# EAGLE design badge (EAGLE 9.5.1)
This is an electronic name badge for DigiGirls
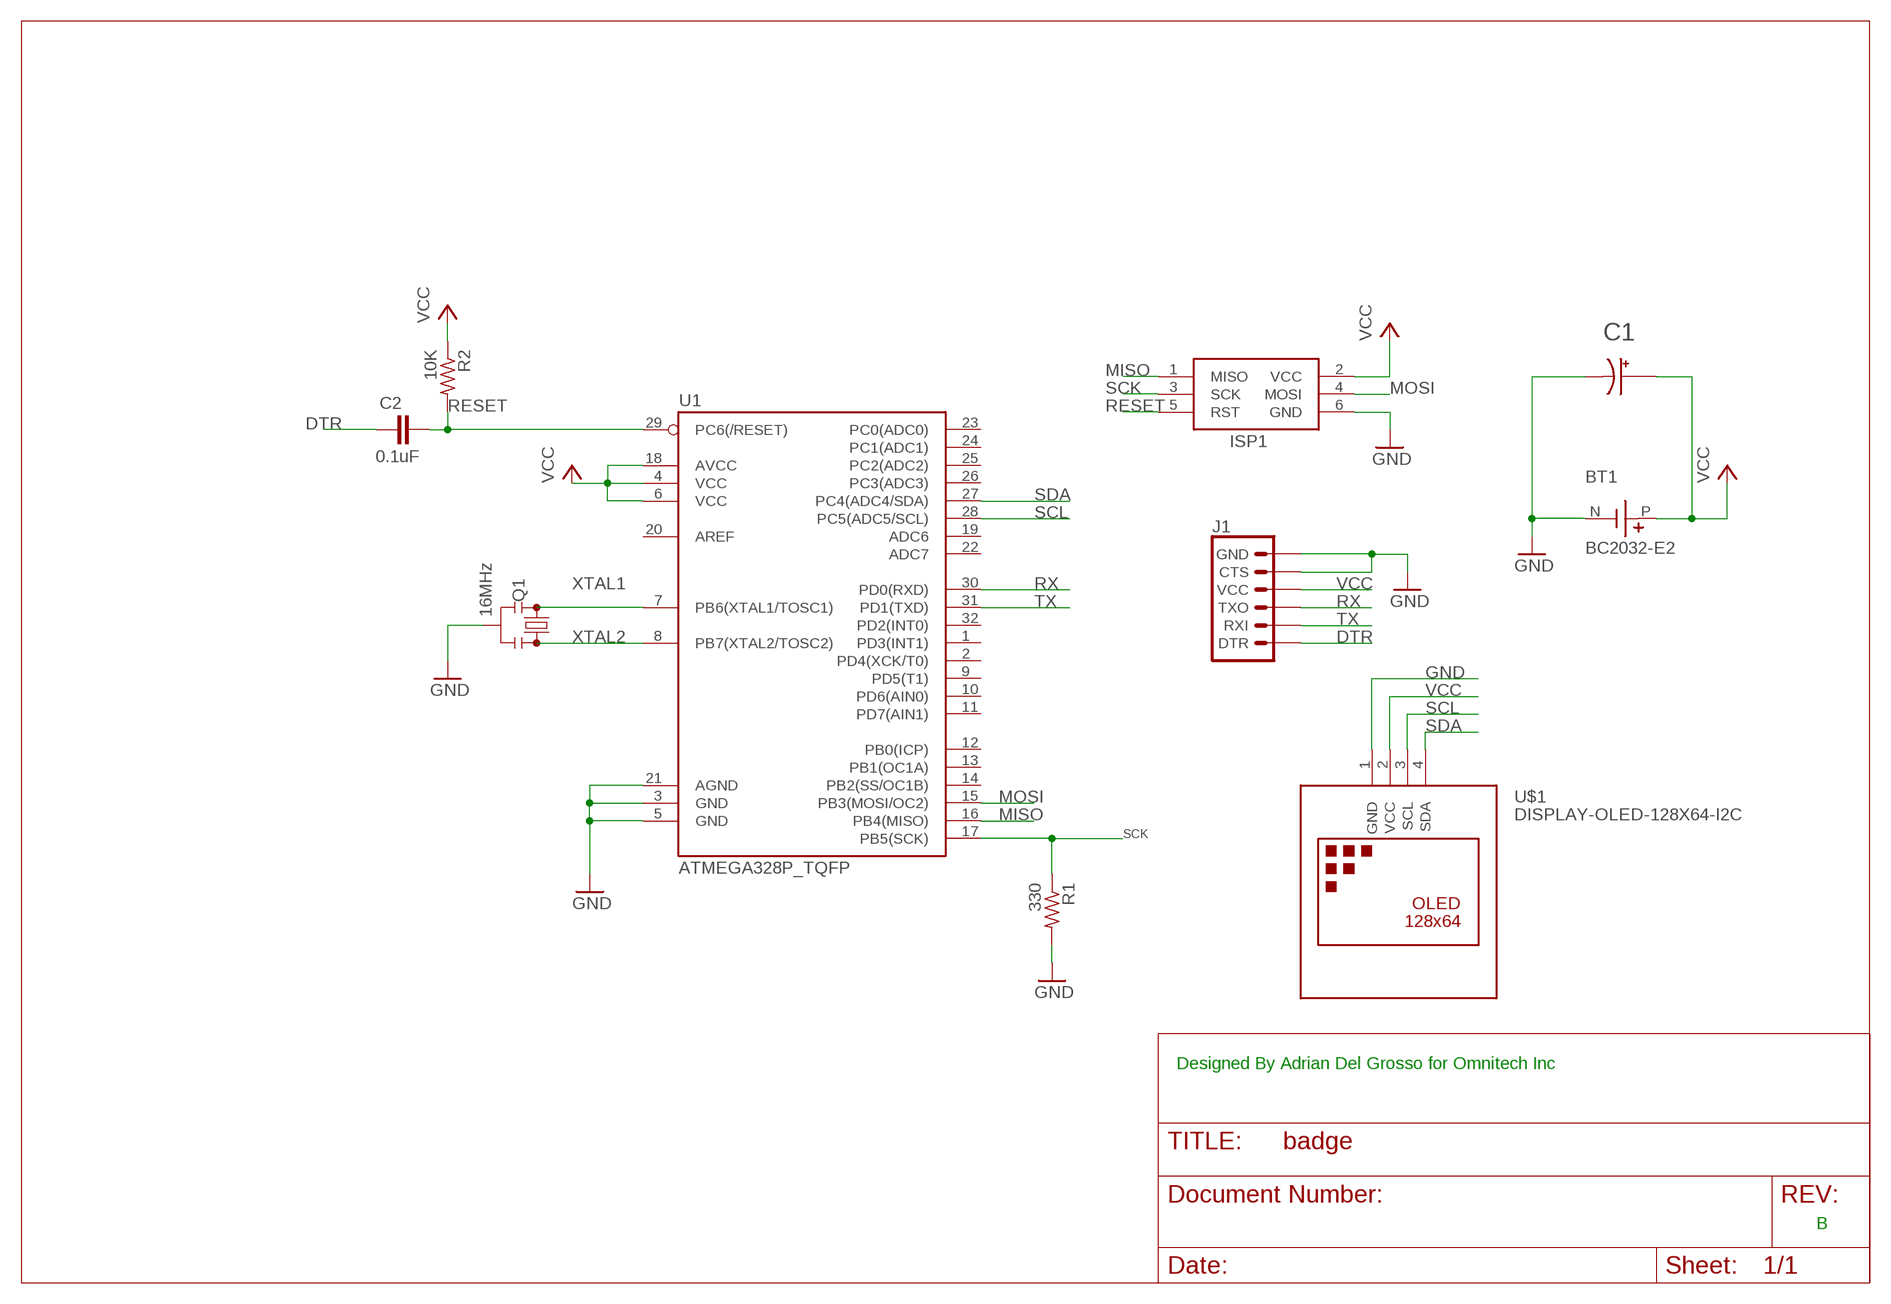
[diagram p0: schematic, sheet 1]

## Parts
BT1  BC2032-E2  [MPD_BC2032-E2]
C1  RNE1C101MDS1PX  [CAPPRD200W50D500H1000]
C2  0.1uF  0.1UF-0402-16V-10%  [0402]
ISP1  AVRISP-6  [AVRISP]
J1  6_PIN_SERIAL_TARGETLONGPADS  [1X06_LONGPADS]
Q1  16MHz  RESONATOR-8MHZSMD_3.2X1.3  [RESONATOR-SMD-3.2X1.3]
R1  330  R-US_R0603  [R0603]
R2  10K  R-US_R0603  [R0603]
U1  ATMEGA328P_TQFP  [TQFP32-08]
U$1  DISPLAY-OLED-128X64-I2C  [DISPLAY-OLED-128X64-I2C]

## Nets
DTR: C2.1 J1.1(DTR)
GND: BT1.N C1.2(N) ISP1.6(GND) J1.5(CTS) J1.6(GND) Q1.2 R1.2 U1.3(GND) U1.5(GND) U1.21(AGND) U$1.1(GND)
MISO: ISP1.1(MISO) U1.16(PB4(MISO))
MOSI: ISP1.4(MOSI) U1.15(PB3(MOSI/OC2))
RESET: C2.2 ISP1.5(RST) R2.2 U1.29(PC6(/RESET))
RX: J1.3(TXO) U1.30(PD0(RXD))
SCK: ISP1.3(SCK) R1.1 U1.17(PB5(SCK))
SCL: U1.28(PC5(ADC5/SCL)) U$1.3(SCL)
SDA: U1.27(PC4(ADC4/SDA)) U$1.4(SDA)
TX: J1.2(RXI) U1.31(PD1(TXD))
VCC: BT1.P C1.1(P) ISP1.2(VCC) J1.4(VCC) R2.1 U1.4(VCC) U1.6(VCC) U1.18(AVCC) U$1.2(VCC)
XTAL1: Q1.1 U1.7(PB6(XTAL1/TOSC1))
XTAL2: Q1.3 U1.8(PB7(XTAL2/TOSC2))
Unconnected: U1.1(PD3(INT1)) U1.2(PD4(XCK/T0)) U1.9(PD5(T1)) U1.10(PD6(AIN0)) U1.11(PD7(AIN1)) U1.12(PB0(ICP)) U1.13(PB1(OC1A)) U1.14(PB2(SS/OC1B)) U1.19(ADC6) U1.20(AREF) U1.22(ADC7) U1.23(PC0(ADC0)) U1.24(PC1(ADC1)) U1.25(PC2(ADC2)) U1.26(PC3(ADC3)) U1.32(PD2(INT0))

## Notes on the sheet
- Designed By Adrian Del Grosso for Omnitech Inc
- B

## Library data of the parts
BT1 = BC2032-E2:BC2032-E2: Holder Battery Cr2032 Sony Equal; DESCRIPTION: BATTERY HOLDER COIN 20MM PC PIN; DIGI-KEY_PART_NUMBER: BC2032-E2-ND; DIGI-KEY_PURCHASE_URL: https://www.digikey.com/product-detail/en/mpd-memory-protection-devices/BC2032-E2/BC2032-E2-ND/2077836?utm_source=snapeda&utm_medium=aggregator&utm_campaign=symbol; MF: MPD _Memory; MP: BC2032-E2; PACKAGE: None
C1 = RNE1C101MDS1PX:RNE1C101MDS1PX: CAP ALUM POLY 100UF 20% 16V T/H; DESCRIPTION: Cap Aluminum Polymer 100uF 16VDC 20% _5 X 10mm_ Radial 2mm 0.035 Ohm 2300mA 2000h 105C T/R; DIGI-KEY_PART_NUMBER: 493-3813-1-ND; DIGI-KEY_PURCHASE_URL: https://www.digikey.com/product-detail/en/nichicon/RNE1C101MDS1PX/493-3813-1-ND/2239226?utm_source=snapeda&utm_medium=aggregator&utm_campaign=symbol; MF: Nichicon; MP: RNE1C101MDS1PX; PACKAGE: Radial Nichicon
C2 = SparkFun-Capacitors:0.1UF: 0.1µF ceramic capacitors A capacitor is a passive two-terminal electrical component used to store electrical energy temporarily in an electric field.; PROD_ID: CAP-12416
ISP1 = adafruit:AVRISP: AVR ISP HEADER Standard 6 pin header for AVR programming
J1 = SparkFun-Connectors:6_PIN_SERIAL_TARGET: 6-pin header connection for use with the "FTDI BASIC" pinout - TARGET SIDE. Also known as "Arduino Serial Program Header". It is used to mate with our FTDI Basic serial programmers using the Arduino IDE. Note, this device has "TARGET" in the name. It is intended to be used on a design that contains a target micro-controller that you wish to program. The "sister" device, named "CABLE" is inteneded to be used on a design that usually lives on the end of your USB cable and prvides the converter chip (FTDI232 or FTDI231x) to commnicate serial RX/TX. You can populate with some of these: Break Away Headers - Straight <https://www.sparkfun.com/products/116> (PRT-00116) For reference (or to suit your programming needs) check out these designs: SparkFun FTDI Basic Breakout - 5V <https://www.sparkfun.com/products/9716> (DEV-09716) SparkFun FTDI Basic Breakout - 3.3V <https://www.sparkfun.com/products/9873> (DEV-09873) SparkFun FTDI SmartBasic <https://www.sparkfun.com/products/12935> (DEV-12935) SparkFun Beefy 3 - FTDI Basic Breakout <https://www.sparkfun.com/products/13746> (DEV-13746)
Q1 = SparkFun-Clocks:RESONATOR-8MHZ: 8MHz Resonator Digikey Example <http://www.digikey.com/product-detail/en/murata-electronics-north-america/CSTCE10M0G55-R0/490-1196-1-ND/584633> Frequency: 8MHz Frequency Stability: ±0.2% Frequency Tolerance: ±0.5% Capacitance: 33pF SparkFun Products Arduino Pro Mini 328- 3.3V/8MHz <https://www.sparkfun.com/products/11114> SparkFun Digital Sandbox <https://www.sparkfun.com/products/12651>; PROD_ID: XTAL-08895; VALUE: 8MHz
R1 R2 = adafruit:R-US_: RESISTOR, American symbol
U1 = SparkFun-IC-Microcontroller:ATMEGA328P_TQFP: Popular 328P in QFP Storefront component: ATmega328 - TQFP <https://www.sparkfun.com/products/13448> (COM-13448) Datasheet <http://www.sparkfun.com/datasheets/Components/SMD/ATMega328.pdf> SparkFun Products SparkFun RedBoard - Programmed with Arduino <https://www.sparkfun.com/products/12757> (DEV-12757) Arduino Pro Mini 328 - 5V/16MHz <https://www.sparkfun.com/products/11113> (DEV-11113) Arduino Pro Mini 328 - 3.3V/8MHz <https://www.sparkfun.com/products/11114> (DEV-11114) SparkFun OpenLog <https://www.sparkfun.com/products/13712> (DEV-13712) SparkFun MicroView - OLED Arduino Module <https://www.sparkfun.com/products/12923> (DEV-12923) SparkFun Digital Sandbox <https://www.sparkfun.com/products/12651> (DEV-12651) SparkFun PicoBoard <https://www.sparkfun.com/products/11888> (WIG-11888) Arduino Fio <https://www.sparkfun.com/products/10116> (DEV-10116) LilyPad Arduino 328 Main Board <https://www.sparkfun.com/products/13342> (DEV-13342) SparkFun RedStick <https://www.sparkfun.com/products/13741> (DEV-13741) LilyPad MP3 <https://www.sparkfun.com/products/11013> (DEV-11013) LilyPad Arduino SimpleSnap <https://www.sparkfun.com/products/10941> (DEV-10941) SparkFun Stepoko <https://www.sparkfun.com/products/13899> (ROB-13899) SparkFun Geiger Counter <https://www.sparkfun.com/products/11345> (SEN-11345) SparkFun EL Sequencer <https://www.sparkfun.com/products/12781> (COM-12781) Arduino Pro 328 - 5V/16MHz <https://www.sparkfun.com/products/10915> (DEV-10915) CryptoCape <https://www.sparkfun.com/products/12773> (DEV-12773) SparkFun IR Thermometer Evaluation Board - MLX90614 <https://www.sparkfun.com/products/10740> (SEN-10740) SparkFun RedBot Mainboard <https://www.sparkfun.com/products/12097> (ROB-12097) Arduino Pro 328 - 3.3V/8MHz <https://www.sparkfun.com/products/10914> (DEV-10914) SparkFun Block for Intel® Edison - Arduino <https://www.sparkfun.com/products/13036> (DEV-13036) SparkFun Simon Says - Surface Mount Soldering Kit <https://www.sparkfun.com/products/10935> (KIT-10935) SparkFun 7-Segment Serial Display - Red <https://www.sparkfun.com/products/11441> (COM-11441) SparkFun 7-Segment Serial Display - White <https://www.sparkfun.com/products/11629> (COM-11629) SparkFun 7-Segment Serial Display - Yellow <https://www.sparkfun.com/products/11443> (COM-11443) SparkFun 7-Segment Serial Display - Kelly Green <https://www.sparkfun.com/products/11440> (COM-11440) SparkFun 7-Segment Serial Display - Blue <https://www.sparkfun.com/products/11442> (COM-11442) SparkFun OpenSegment Serial Display - 20mm (Blue) <https://www.sparkfun.com/products/11647> (COM-11647) SparkFun OpenSegment Serial Display - 20mm (Green) <https://www.sparkfun.com/products/11646> (COM-11646) SparkFun OpenSegment Serial Display - 20mm (White) <https://www.sparkfun.com/products/11648> (COM-11648) SparkFun OpenSegment Serial Display - 20mm (Red) <https://www.sparkfun.com/products/11644> (COM-11644) SparkFun OpenSegment Serial Display - 20mm (Yellow) <https://www.sparkfun.com/products/11645> (COM-11645) SparkFun OpenSegment Shield <https://www.sparkfun.com/products/13190> (DEV-13190); PROD_ID: IC-09069
U$1 = diy-modules:DISPLAY-OLED-128X64-I2C: 128x64 Dot Matrix OLED Module based on SSD1306 chip Variant with I2C interface More details available here: http://www.instructables.com/id/Monochrome-096-i2c-OLED-display-with-arduino-SSD13/ SSD1306 datasheet: https://cdn-shop.adafruit.com/datasheets/SSD1306.pdf Click here to find device on ebay.com <http://www.ebay.com/sch/oled+display+128x64+iic> Note: There are two variants: I2C and SPI. Search for the proper version.

## Board
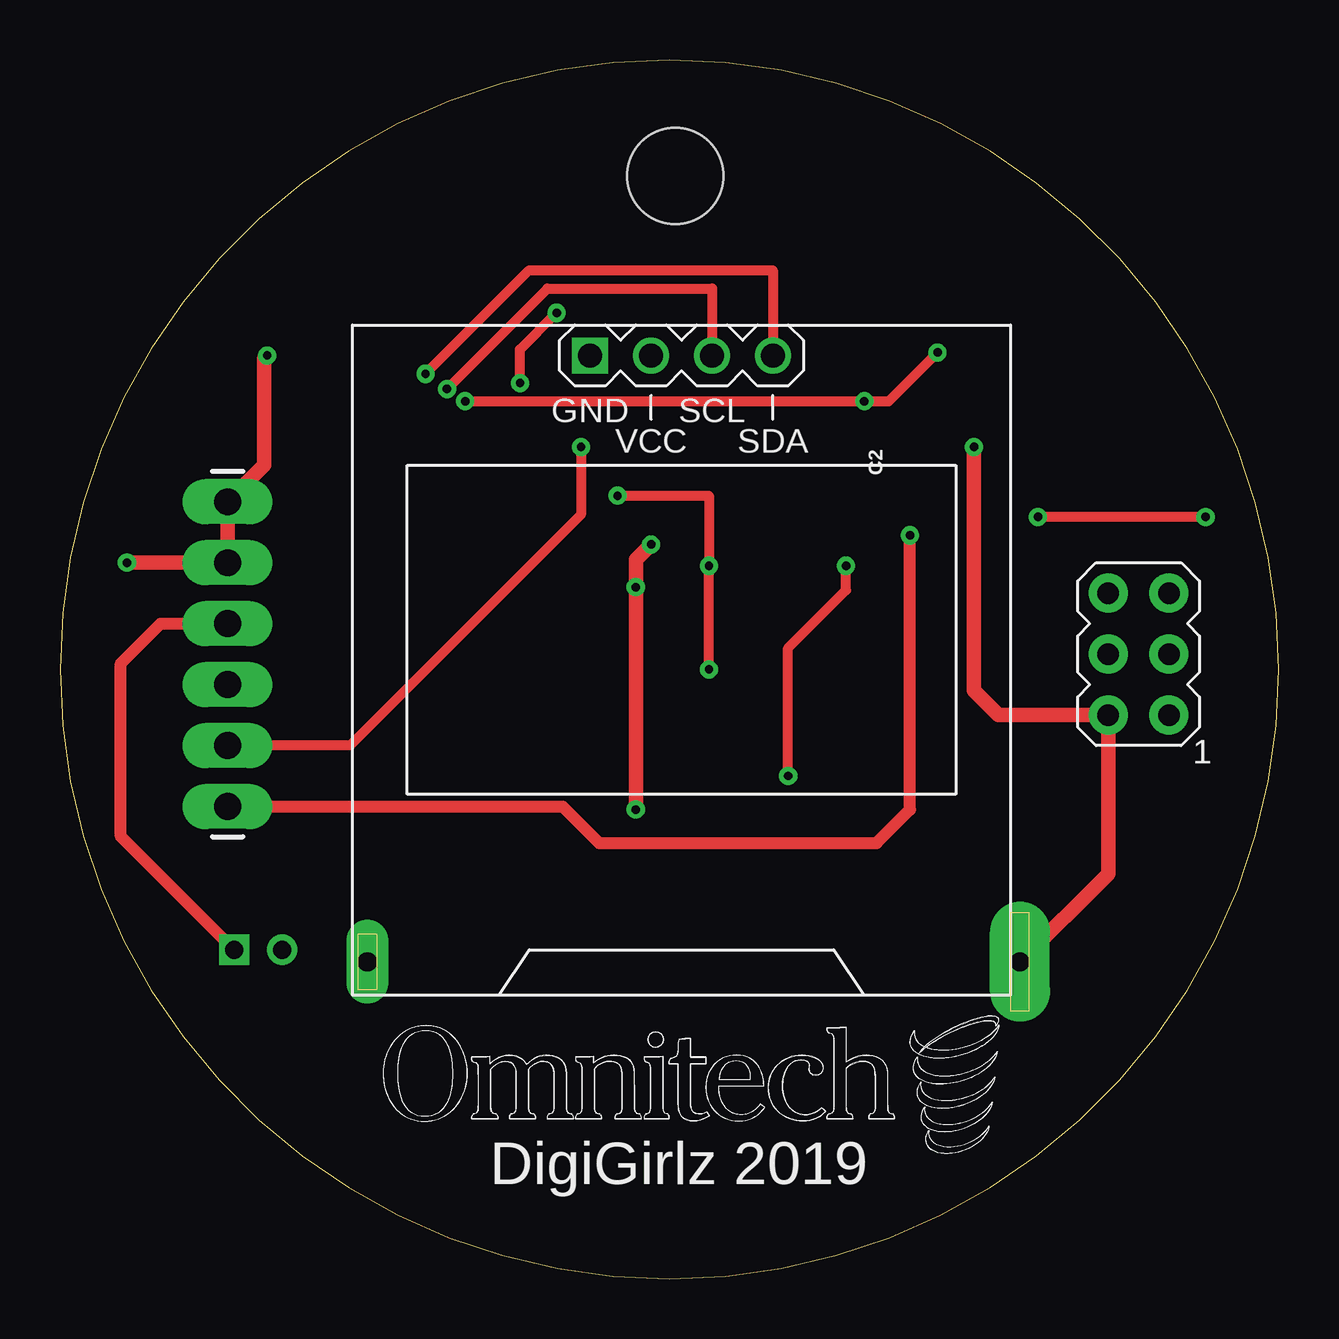
[diagram p1: board, top side]
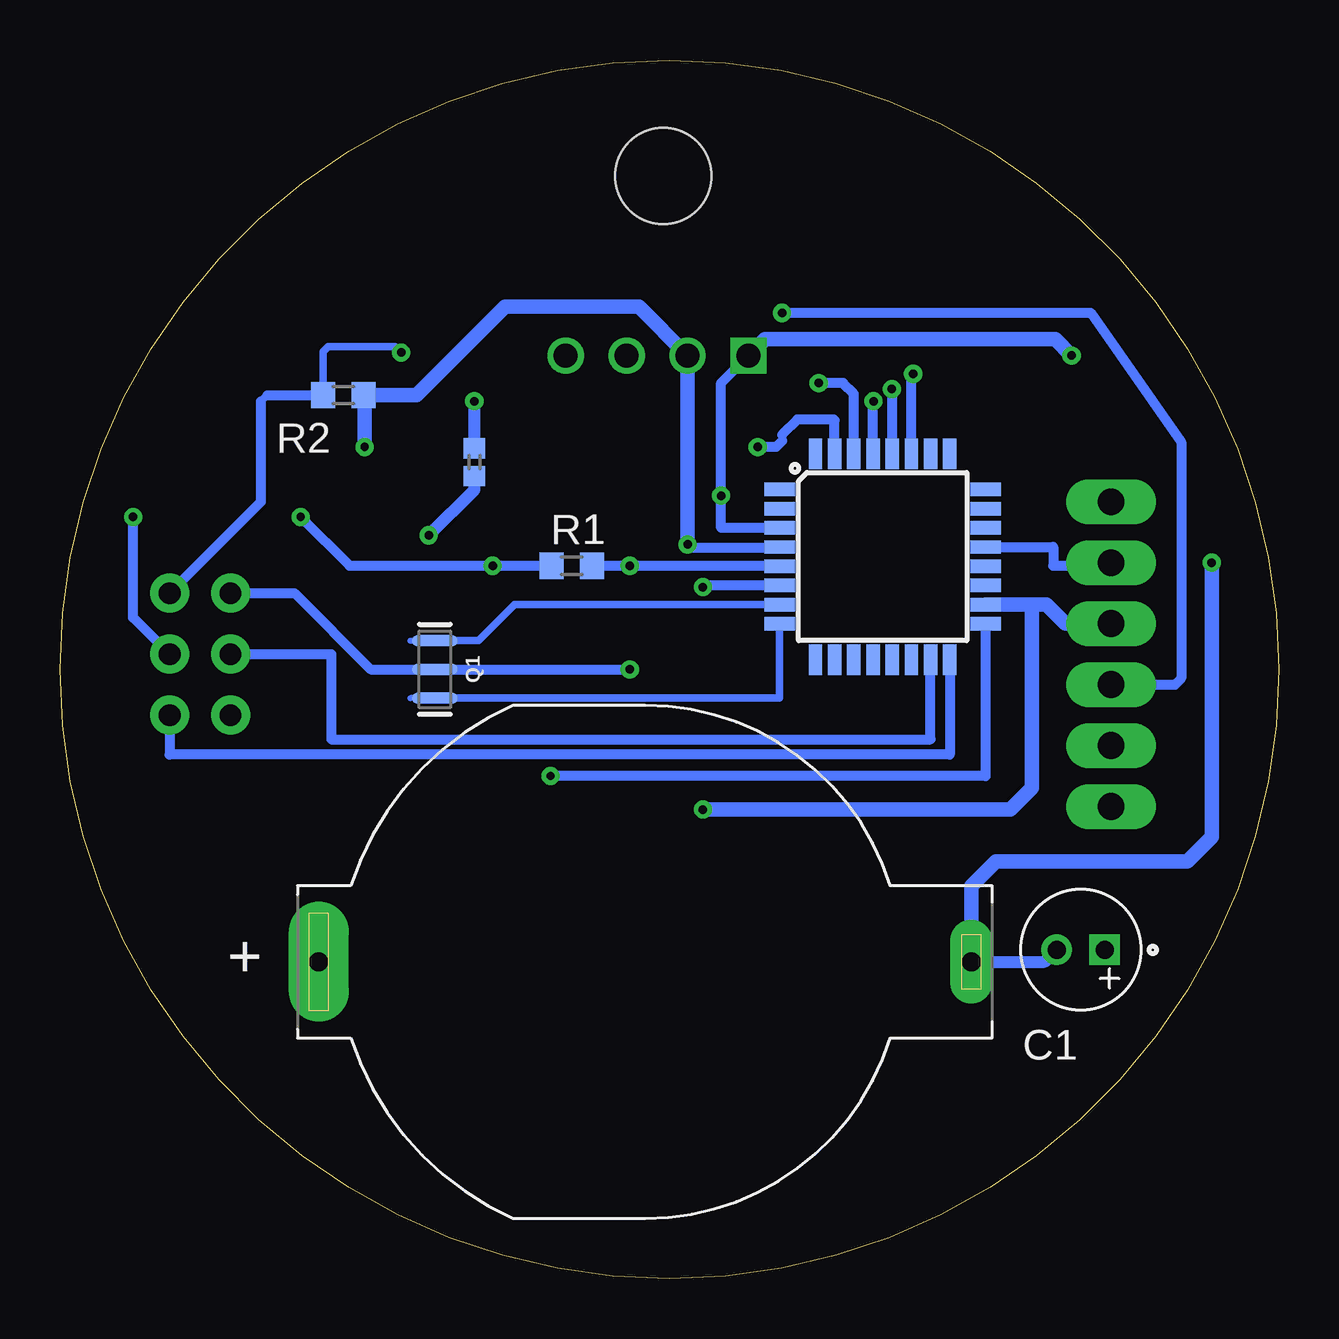
[diagram p2: board, bottom side, seen from below]

Size 50.8 x 50.8 mm. Coordinates in mm from the lower left corner, seen from the top.
Outline: 0,25.4 arc90 25.4,0 arc90 50.8,25.4 arc90 25.4,50.8 arc90 0,25.4
Copper layers (1*16): Top 0.035mm / dielectric 1.5mm / Bottom 0.035mm
Design rules "default": minimum track width 6mil, minimum drill 0.35mm, track to track 6mil, track to pad 6mil, pad to pad 6mil, via to via 6mil, smd to smd 6mil, copper to edge 40mil, drill to drill 6mil, minimum pad ring 10mil, minimum via ring 8mil, stop-mask expansion 4mil, vias tented up to drill 0mil, thermal gap 10mil
Holes 4 mm at 25.65,45.97

### Footprints (pad centres in the part's own frame; a part is rotated, then mirrored left to right if it is on the bottom)
MPD_BC2032-E2 = drill 0.8 pad 1.75 long: N 13.6,0 | drill 0.8 pad 2.5 long: P -13.6,0
CAPPRD200W50D500H1000 = drill 0.75 pad 1.15 square: 1 -1,0 | drill 0.75 pad 1.15: 2 1,0
0402 = smd 0.85 x 0.9: 1 -0.58,0; 2 0.58,0
AVRISP = drill 0.9 pad 1.626: 1 -1.27,2.54; 2 1.27,2.54; 3 -1.27,0; 4 1.27,0; 5 -1.27,-2.54; 6 1.27,-2.54
1X06_LONGPADS = drill 1.118 pad 1.88 long: 1 0,0; 2 2.54,0; 3 5.08,0; 4 7.62,0; 5 10.16,0; 6 12.7,0
RESONATOR-SMD-3.2X1.3 = smd 0.45 x 1.905: 1 -1.2,0; 2 0,0; 3 1.2,0
R0603 = smd 1 x 1.1: 1 -0.85,0; 2 0.85,0
TQFP32-08 = smd 1.27 x 0.559: 1 -4.293,2.8; 2 -4.293,2; 3 -4.293,1.2; 4 -4.293,0.4; 5 -4.293,-0.4; 6 -4.293,-1.2; 7 -4.293,-2; 8 -4.293,-2.8; 17 4.293,-2.8; 18 4.293,-2; 19 4.293,-1.2; 20 4.293,-0.4; 21 4.293,0.4; 22 4.293,1.2; 23 4.293,2; 24 4.293,2.8 | smd 0.559 x 1.27: 9 -2.8,-4.293; 10 -2,-4.293; 11 -1.2,-4.293; 12 -0.4,-4.293; 13 0.4,-4.293; 14 1.2,-4.293; 15 2,-4.293; 16 2.8,-4.293; 25 2.8,4.293; 26 2,4.293; 27 1.2,4.293; 28 0.4,4.293; 29 -0.4,4.293; 30 -1.2,4.293; 31 -2,4.293; 32 -2.8,4.293
DISPLAY-OLED-128X64-I2C = drill 1 square: 1 -3.81,12.7 | drill 1: 2 -1.27,12.7; 3 1.27,12.7; 4 3.81,12.7

### Placement (x,y rotation side)
BT1  26.42,13.21 0 bottom
C1  8.26,13.72 180 bottom
C2  33.53,34.04 90 bottom
ISP1  44.96,26.04 180 top
J1  6.99,19.68 90 top
Q1  35.18,25.4 270 bottom
R1  29.46,29.72 0 bottom
R2  38.99,36.83 180 bottom
U1  16.51,30.1 0 bottom
U$1  25.91,25.78 0 top

### Tracks (layer width: path | path; a pad name or v marks a point on that pad's centre or on a via)
DTR  (via drill 0.35)
  Top 0.508: J1.1 20.95,19.68 22.48,18.16 34.04,18.16 35.43,19.56 v35.43,30.99
  Bottom 0.508: v35.43,30.99 33.53,32.89 C2.1
GND  (via drill 0.35)
  Top 0.305: v8.64,38.48 8.51,38.35
  Top 0.406: v27.05,25.4 v27.05,29.72 27.05,32.64 v23.24,32.64
  Top 0.61: 8.51,38.35 8.51,33.91 J1.6 J1.5 v2.79,29.84
  Bottom 0.305: 6.99,29.72 J1.5 | 20.82,29.72 U1.5
  Bottom 0.406: U$1.1 23.24,37.34 v23.24,32.64 23.24,31.3 U1.3 | U1.21 9.4,30.5 9.4,29.72 6.99,29.72 | ISP1.6 41.02,28.57 37.85,25.4 Q1.2 v27.05,25.4 | R1.2 v27.05,29.72 20.82,29.72
  Bottom 0.508: BT1.N 9.76,13.21 C1.2
  Bottom 0.61: v8.64,38.48 9.32,39.16 21.41,39.16 U$1.1 | v2.79,29.84 2.79,18.41 3.81,17.4 11.8,17.4 12.82,16.38 BT1.N
MISO
  Bottom 0.406: ISP1.1 46.23,21.84 13.71,21.84 U1.16
MOSI
  Bottom 0.406: ISP1.4 39.5,26.04 39.5,22.48 14.51,22.48 U1.15
RESET  (via drill 0.35)
  Top 0.406: v16.89,36.58 v33.53,36.58 34.54,36.58 v36.58,38.61
  Bottom 0.305: 16.91,36.58 v16.89,36.58 | 42.42,36.58 42.16,36.83 | R2.2 39.84,38.65 39.62,38.86 36.83,38.86 v36.58,38.61
  Bottom 0.406: U1.29 16.91,36.58 | ISP1.5 42.42,32.38 42.42,36.58 | 42.16,36.83 R2.2
  Bottom 0.508: C2.2 v33.53,36.58
RX  (via drill 0.35)
  Top 0.406: v19.18,37.34 19.18,38.73 v20.7,40.26
  Bottom 0.406: U1.30 17.71,36.89 18.16,37.34 v19.18,37.34 | J1.3 4.32,24.77 4.06,25.02 4.06,34.87 7.83,40.26 v20.7,40.26
SCK  (via drill 0.35)
  Top 0.406: v47.75,31.75 v40.77,31.75 | v30.35,20.95 30.35,26.29 32.77,28.7 v32.77,29.72
  Bottom 0.305: U1.17
  Bottom 0.406: ISP1.3 47.75,27.56 v47.75,31.75 | v40.77,31.75 38.73,29.72 v32.77,29.72 R1.1 | U1.17 12.22,20.95 v30.35,20.95
SCL  (via drill 0.35)
  Top 0.406: v16.13,37.08 20.32,41.27 27.18,41.27 U$1.3
  Bottom 0.305: 16.11,37.08 v16.13,37.08
  Bottom 0.406: U1.28 16.11,37.08
SDA  (via drill 0.35)
  Top 0.406: v15.24,37.72 19.56,42.04 29.72,42.04 U$1.4
  Bottom 0.305: 15.31,37.72 v15.24,37.72
  Bottom 0.406: U1.27 15.31,37.72
TX  (via drill 0.35)
  Top 0.305: J1.2 7.01,22.25
  Top 0.406: 7.01,22.25 12.12,22.25 21.72,31.84 v21.72,34.67
  Bottom 0.305: 18.51,35.78 18.54,35.81 | 20.7,35.18 20.7,34.92
  Bottom 0.406: U1.31 18.51,35.78 | 18.54,35.81 20.07,35.81 20.7,35.18 | 20.7,34.92 20.95,34.67 v21.72,34.67
VCC  (via drill 0.35)
  Top 0.508: C1.1 2.54,18.43 2.54,25.65 4.19,27.3 J1.4
  Top 0.61: v38.1,34.67 38.1,24.51 39.12,23.5 ISP1.2 43.69,16.88 BT1.P | v24,19.56 v24,28.83 24,29.97 v24.64,30.61
  Bottom 0.305: v24.64,30.61 24.51,30.48 | 20.82,30.48 U1.4 | 38.1,36.79 R2.1 | 24,28.9 v24,28.83
  Bottom 0.406: 24.51,30.48 20.82,30.48 | U1.6 24,28.9
  Bottom 0.61: R2.1 35.94,36.83 32.26,40.51 26.67,40.51 U$1.2 v24.64,30.61 | v38.1,34.67 38.1,36.79 | J1.4 8.89,27.3 9.68,28.1 10.29,28.1 | 10.29,28.1 U1.18 | 10.29,28.1 10.29,20.45 11.18,19.56 v24,19.56
XTAL1
  Bottom 0.305: Q1.1 33.34,26.6 31.84,28.1 U1.7
XTAL2
  Bottom 0.305: Q1.3 20.8,24.2 U1.8

### Text on the board
tPlace: DigiGirlz 2019